# EAGLE design Remote Temp Sensor - Remote Unit (EAGLE 5.06)
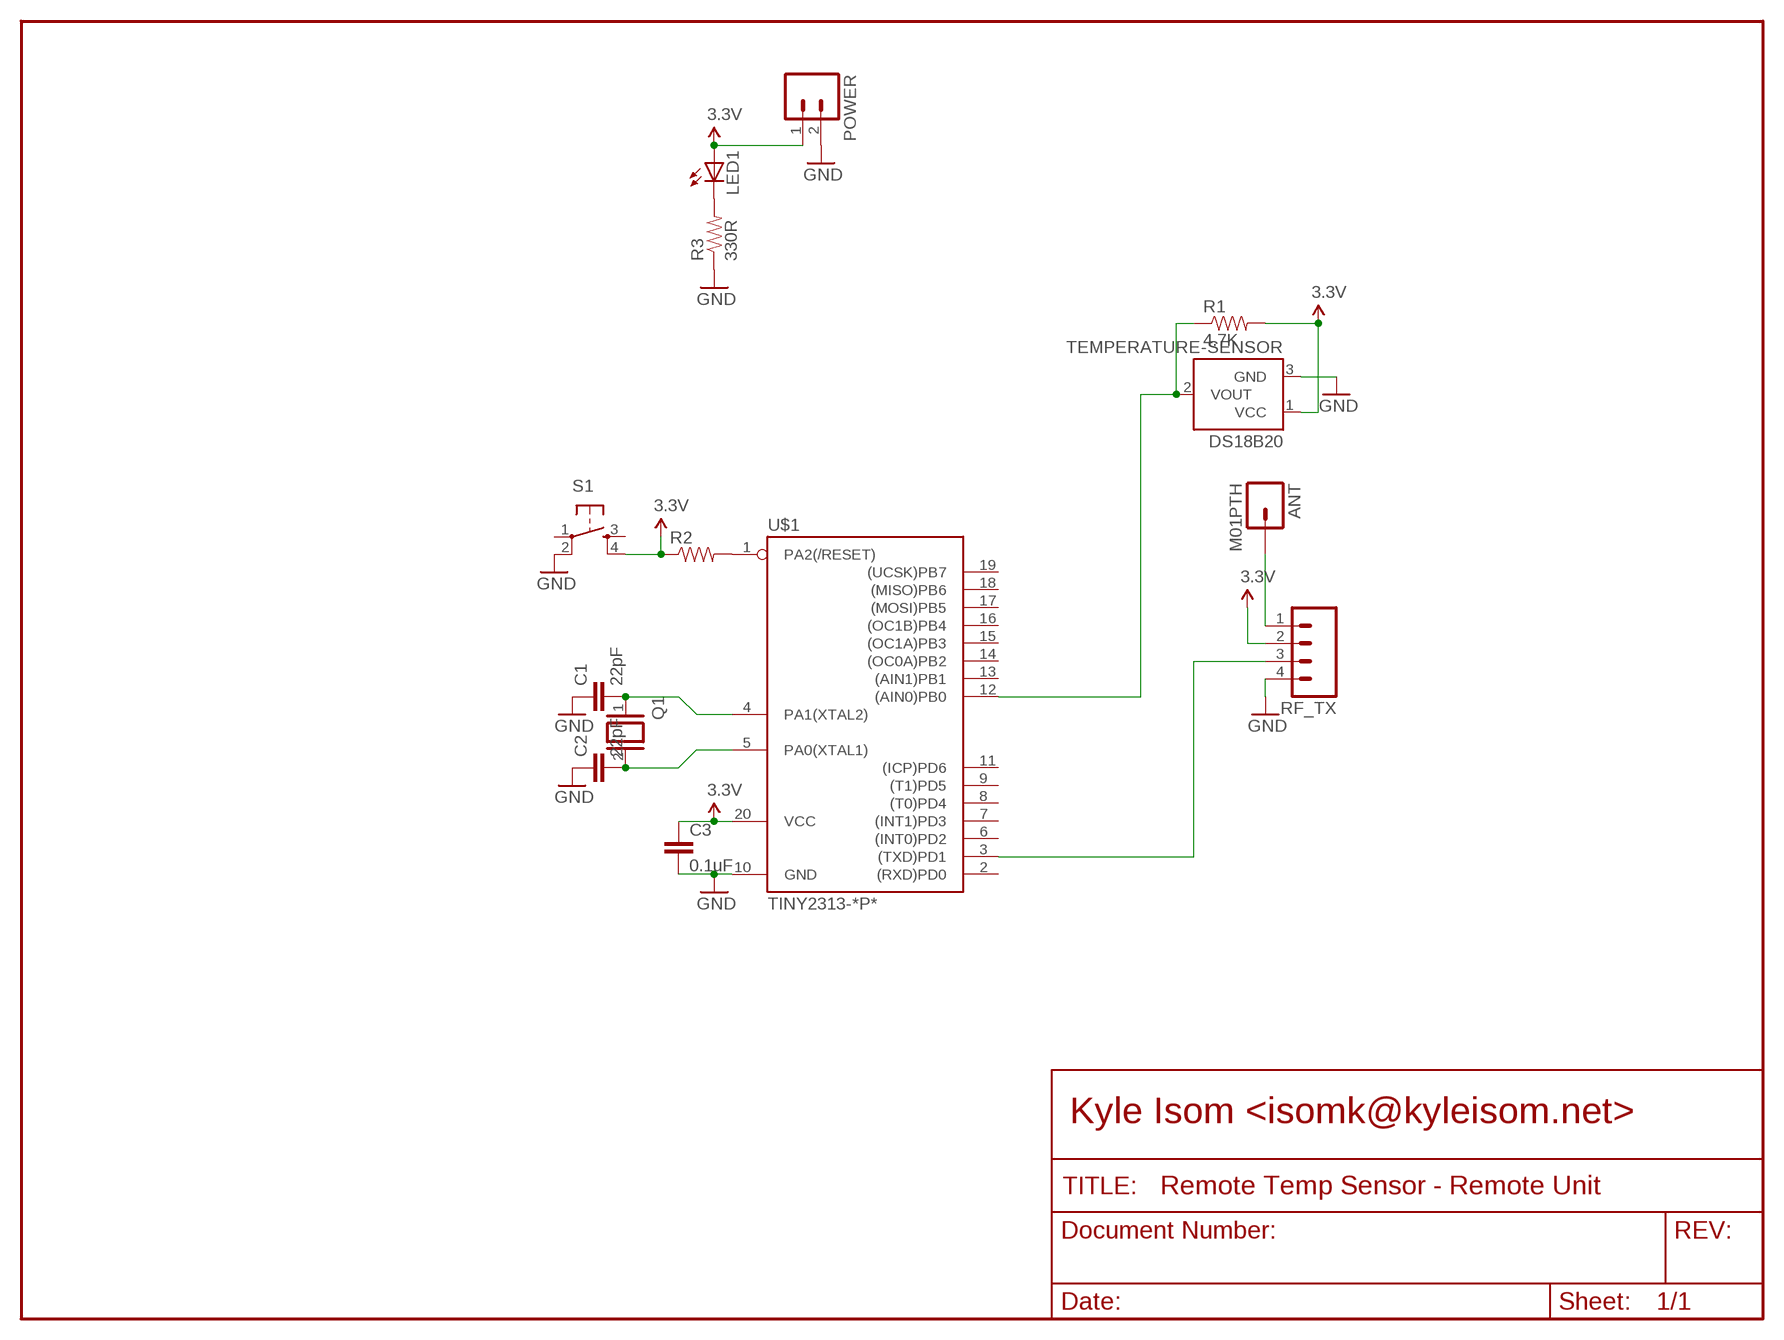
[diagram p0: schematic, sheet 1]

## Parts
ANT  M01PTH  [1X01]
C1  22pF  CAPPTH1  [CAP-PTH-5MM]
C2  22pF  CAPPTH1  [CAP-PTH-5MM]
C3  0.1uF  CAPPTH1  [CAP-PTH-5MM]
DS18B20  TEMPERATURE-SENSOR  [TO-92]
LED1  LED3MM  [LED3MM]
POWER  M02LOCK  [1X02_LOCK]
Q1  XTAL/S  [QS]
R1  4.7K  RESISTORPTH1  [AXIAL-0.3]
R2  RESISTORPTH1  [AXIAL-0.3]
R3  330R  RESISTORPTH1  [AXIAL-0.3]
RF_TX  M04LOCK  [1X04_LOCK]
S1  TAC_SWITCHPTH  [TACTILE-PTH]
U$1  TINY2313-*P*  [DIL20]

## Nets
3.3V: C3.1 DS18B20.1(VCC) LED1.A POWER.1 R1.P$2 R2.P$1 RF_TX.2 S1.4 U$1.20(VCC)
GND: C1.1 C2.1 C3.2 DS18B20.3(GND) POWER.2 R3.P$1 RF_TX.4 S1.2 U$1.10(GND)
N$1: R2.P$2 U$1.1(PA2(/RESET))
N$2: C1.2 Q1.1 U$1.4(PA1(XTAL2))
N$3: C2.2 Q1.2 U$1.5(PA0(XTAL1))
N$4: ANT.1 RF_TX.1
N$5: RF_TX.3 U$1.3((TXD)PD1)
N$7: DS18B20.2(VOUT) R1.P$1 U$1.12((AIN0)PB0)
N$8: LED1.K(C) R3.P$2
Unconnected: S1.1 S1.3 U$1.2((RXD)PD0) U$1.6((INT0)PD2) U$1.7((INT1)PD3) U$1.8((T0)PD4) U$1.9((T1)PD5) U$1.11((ICP)PD6) U$1.13((AIN1)PB1) U$1.14((OC0A)PB2) U$1.15((OC1A)PB3) U$1.16((OC1B)PB4) U$1.17((MOSI)PB5) U$1.18((MISO)PB6) U$1.19((UCSK)PB7)

## Notes on the sheet
- Kyle Isom <isomk@kyleisom.net>

## Library data of the parts
ANT = SparkFun:M01: Header 1 Standard 1-pin 0.1" header. Use with straight break away headers (SKU : PRT-00116), right angle break away headers (PRT-00553), swiss pins (PRT-00743), machine pins (PRT-00117), and female headers (PRT-00115).
C1-C3 = SparkFun:CAP: Capacitor Standard 0603 ceramic capacitor, and 0.1" leaded capacitor.
DS18B20 = SparkFun:TEMPERATURE-SENSOR
LED1 = led:LED: LED OSRAM: - CHIPLED LG R971, LG N971, LY N971, LG Q971, LY Q971, LO R971, LY R971 LH N974, LH R974 LS Q976, LO Q976, LY Q976 LO Q996 - Hyper CHIPLED LW Q18S LB Q993, LB Q99A, LB R99A - SideLED LS A670, LO A670, LY A670, LG A670, LP A670 LB A673, LV A673, LT A673, LW A673 LH A674 LY A675 LS A676, LA A676, LO A676, LY A676, LW A676 LS A679, LY A679, LG A679 - Hyper Micro SIDELED® LS Y876, LA Y876, LO Y876, LY Y876 LT Y87S - SmartLED LW L88C, LW L88S LB L89C, LB L89S, LG L890 LS L89K, LO L89K, LY L89K LS L896, LA L896, LO L896, LY L896 - TOPLED LS T670, LO T670, LY T670, LG T670, LP T670 LSG T670, LSP T670, LSY T670, LOP T670, LYG T670 LG T671, LOG T671, LSG T671 LB T673, LV T673, LT T673, LW T673 LH T674 LS T676, LA T676, LO T676, LY T676, LB T676, LH T676, LSB T676, LW T676 LB T67C, LV T67C, LT T67C, LS T67K, LO T67K, LY T67K, LW E67C LS E67B, LA E67B, LO E67B, LY E67B, LB E67C, LV E67C, LT E67C LW T67C LS T679, LY T679, LG T679 LS T770, LO T770, LY T770, LG T770, LP T770 LB T773, LV T773, LT T773, LW T773 LH T774 LS E675, LA E675, LY E675, LS T675 LS T776, LA T776, LO T776, LY T776, LB T776 LHGB T686 LT T68C, LB T68C - Hyper Mini TOPLED® LB M676 - Mini TOPLED Santana® LG M470 LS M47K, LO M47K, LY M47K Source: http://www.osram.convergy.de LUXEON: - LUMILED® LXK2-PW12-R00, LXK2-PW12-S00, LXK2-PW14-U00, LXK2-PW14-V00 LXK2-PM12-R00, LXK2-PM12-S00, LXK2-PM14-U00 LXK2-PE12-Q00, LXK2-PE12-R00, LXK2-PE12-S00, LXK2-PE14-T00, LXK2-PE14-U00 LXK2-PB12-K00, LXK2-PB12-L00, LXK2-PB12-M00, LXK2-PB14-N00, LXK2-PB14-P00, LXK2-PB14-Q00 LXK2-PR12-L00, LXK2-PR12-M00, LXK2-PR14-Q00, LXK2-PR14-R00 LXK2-PD12-Q00, LXK2-PD12-R00, LXK2-PD12-S00 LXK2-PH12-R00, LXK2-PH12-S00 LXK2-PL12-P00, LXK2-PL12-Q00, LXK2-PL12-R00 Source: www.luxeon.com KINGBRIGHT: KA-3528ASYC Source: www.kingbright.com
POWER = SparkFun:M02: Header 2 Standard 2-pin 0.1" header. Use with straight break away headers (SKU : PRT-00116), right angle break away headers (PRT-00553), swiss pins (PRT-00743), machine pins (PRT-00117), and female headers (PRT-00115). Molex polarized connector foot print use with SKU : PRT-08233 with associated crimp pins and housings.
Q1 = special:XTAL/S: CRYSTAL
R1-R3 = SparkFun:RESISTOR: Resistor Basic schematic elements and footprints for 0603, 1206, and PTH 1/10th watt (small) resistors.
RF_TX = SparkFun:M04: Header 4 Standard 4-pin 0.1" header. Use with straight break away headers (SKU : PRT-00116), right angle break away headers (PRT-00553), swiss pins (PRT-00743), machine pins (PRT-00117), and female headers (PRT-00115). Molex polarized connector foot print use with SKU : PRT-08231 with associated crimp pins and housings.
S1 = SparkFun:TAC_SWITCH: Momentary Switch Button commonly used for reset or general input. Spark Fun Electronics SKU : COM-00097
U$1 = avr-6:TINY2313*: Atmel Tiny2313 2K Flash, 128 bytes EEPROM, 128 bytes RAM

## Board
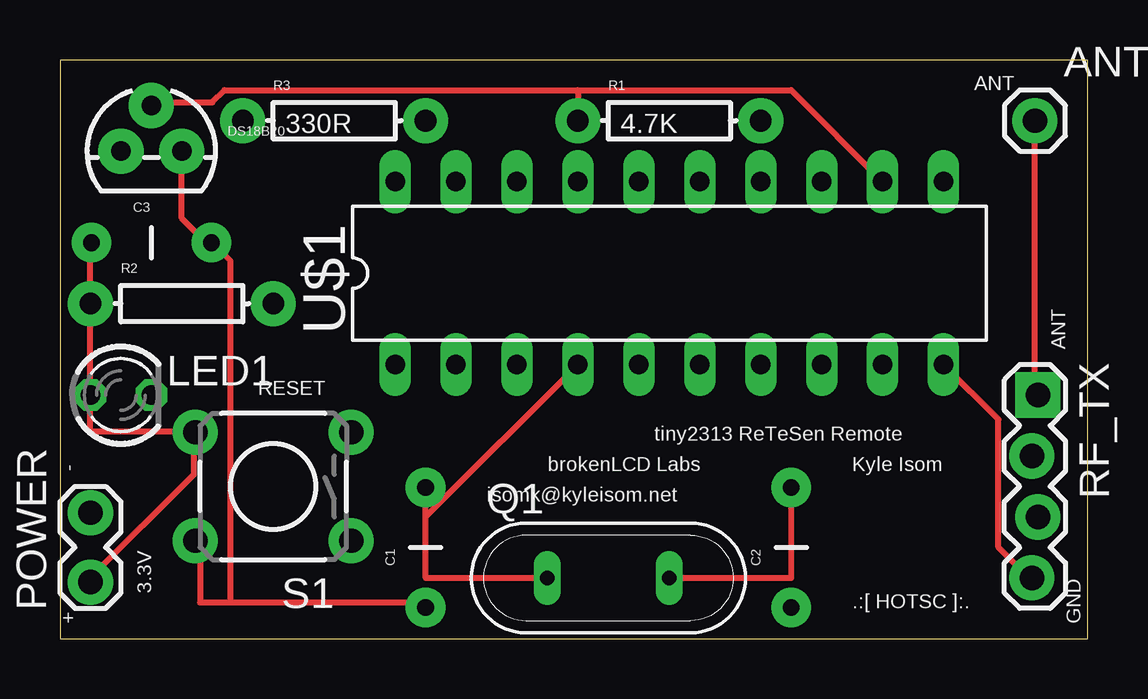
[diagram p1: board, top side]
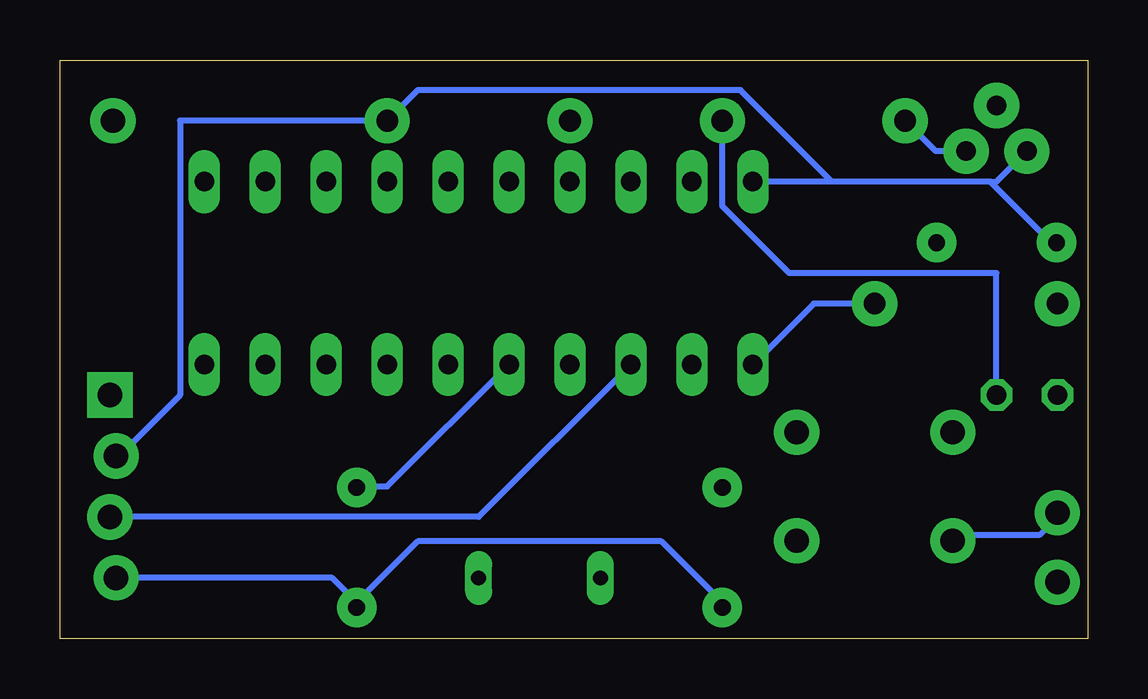
[diagram p2: board, bottom side, seen from below]

Size 42.85 x 24.12 mm. Coordinates in mm from the lower left corner, seen from the top.
Outline: 0,0 42.85,0 42.85,24.12 0,24.12 0,0
Copper layers (1*16): Top 0.035mm / dielectric 1.5mm / Bottom 0.035mm
Design rules "default": minimum track width 10mil, minimum drill 24mil, track to track 8mil, track to pad 8mil, pad to pad 8mil, via to via 8mil, smd to smd 8mil, copper to edge 40mil, drill to drill 8mil, minimum pad ring 10mil, minimum via ring 8mil, stop-mask expansion 4mil, vias tented up to drill 0mil, thermal gap 10mil

### Footprints (pad centres in the part's own frame; a part is rotated, then mirrored left to right if it is on the bottom)
1X01 = drill 1.016 pad 1.88 round: 1 0,0
CAP-PTH-5MM = drill 0.7 pad 1.651 round: 1 -2.5,0; 2 2.5,0
TO-92 = drill 0.813 pad 1.88 round: 1 -1.27,0; 2 0,1.905; 3 1.27,0
LED3MM = drill 0.813 octagon: A -1.27,0; K 1.27,0
1X02_LOCK = drill 1.016 pad 1.88 round: 1 -0.178,0; 2 2.718,0
QS = drill 0.61 long: 1 -2.54,0; 2 2.54,0
AXIAL-0.3 = drill 0.9 pad 1.88 round: P$1 -3.81,0; P$2 3.81,0
1X04_LOCK = drill 1.016 pad 1.88 square: 1 0,0.127 | drill 1.016 pad 1.88 round: 2 2.54,-0.127; 3 5.08,0.127; 4 7.62,-0.127
TACTILE-PTH = drill 1.016 pad 1.88 round: 1 -3.251,2.261; 2 3.251,2.261; 3 -3.251,-2.261; 4 3.251,-2.261
DIL20 = drill 0.813 long: 1 -11.43,-3.81; 2 -8.89,-3.81; 3 -6.35,-3.81; 4 -3.81,-3.81; 5 -1.27,-3.81; 6 1.27,-3.81; 7 3.81,-3.81; 8 6.35,-3.81; 9 8.89,-3.81; 10 11.43,-3.81; 11 11.43,3.81; 12 8.89,3.81; 13 6.35,3.81; 14 3.81,3.81; 15 1.27,3.81; 16 -1.27,3.81; 17 -3.81,3.81; 18 -6.35,3.81; 19 -8.89,3.81; 20 -11.43,3.81

### Placement (x,y rotation side)
ANT  40.64,21.59 0 top
C1  15.24,3.81 90 top
C2  30.48,3.81 90 top
C3  3.81,16.51 0 top
DS18B20  3.81,20.32 0 top
LED1  2.54,10.16 0 top
POWER  1.27,2.54 90 top
Q1  22.86,2.54 0 top
R1  25.4,21.59 0 top
R2  5.08,13.97 0 top
R3  11.43,21.59 0 top
RF_TX  40.64,10.16 270 top
S1  8.89,6.35 180 top
U$1  25.4,15.24 0 top

### Tracks (layer width: path | path; a pad name or v marks a point on that pad's centre or on a via)
3.3V
  Top 0.254: POWER.1 1.27,2.54 5.59,6.86 5.59,8.38 S1.4 5.59,8.64 1.27,8.64 LED1.A R2.P$1 1.27,16.51 C3.1
  Bottom 0.254: 4.06,19.05 3.81,19.05 DS18B20.1 | 4.06,19.05 10.67,19.05 | 10.67,19.05 U$1.20 | 10.67,19.05 14.48,22.86 27.94,22.86 R1.P$2 37.85,21.59 37.85,10.16 40.39,7.62 RF_TX.2 | 4.06,19.05 1.52,16.51 C3.1
GND
  Top 0.254: U$1.10 39.12,9.14 39.12,3.81 40.39,2.54 RF_TX.4 | DS18B20.3 5.08,17.53 6.1,16.51 C3.2 6.35,16.51 7.11,15.75 7.11,1.52 | 7.11,1.52 5.84,1.52 5.84,4.06 S1.2 | 7.11,1.52 15.24,1.52 C1.1
  Bottom 0.254: 30.48,1.52 31.5,2.54 RF_TX.4 | R3.P$1 6.35,20.32 DS18B20.3 | POWER.2 1.27,5.08 2.03,4.32 5.59,4.32 S1.2 | 30.48,1.52 27.94,4.06 17.78,4.06 15.24,1.52 C1.1 | 30.48,1.52 C2.1
N$1
  Bottom 0.254: U$1.1 11.43,13.97 R2.P$2
N$2
  Top 0.254: Q1.1 15.24,2.54 15.24,5.08 | 15.24,5.08 C1.2 | 15.24,5.08 U$1.4
N$3
  Top 0.254: Q1.2 30.48,2.54 C2.2
  Bottom 0.254: U$1.5 29.21,6.35 30.48,6.35 C2.2
N$4
  Top 0.254: ANT.1 40.64,10.16 RF_TX.1
N$5
  Bottom 0.254: U$1.3 25.4,5.08 RF_TX.3
N$7
  Top 0.254: U$1.12 30.48,22.86 21.59,22.86 | 21.59,22.86 R1.P$1 | 21.59,22.86 6.86,22.86 6.35,22.35 3.81,22.35 DS18B20.2
N$8
  Bottom 0.254: LED1.K 3.81,15.24 12.45,15.24 15.24,18.03 R3.P$2

### Text on the board
tPlace: ANT | ANT | RESET | tiny2313 ReTeSen Remote | - | brokenLCD Labs | Kyle Isom | isomk@kyleisom.net | 3.3V | + | .:[ HOTSC ]:. | GND